# Altium project carte_pami26.PrjPcb
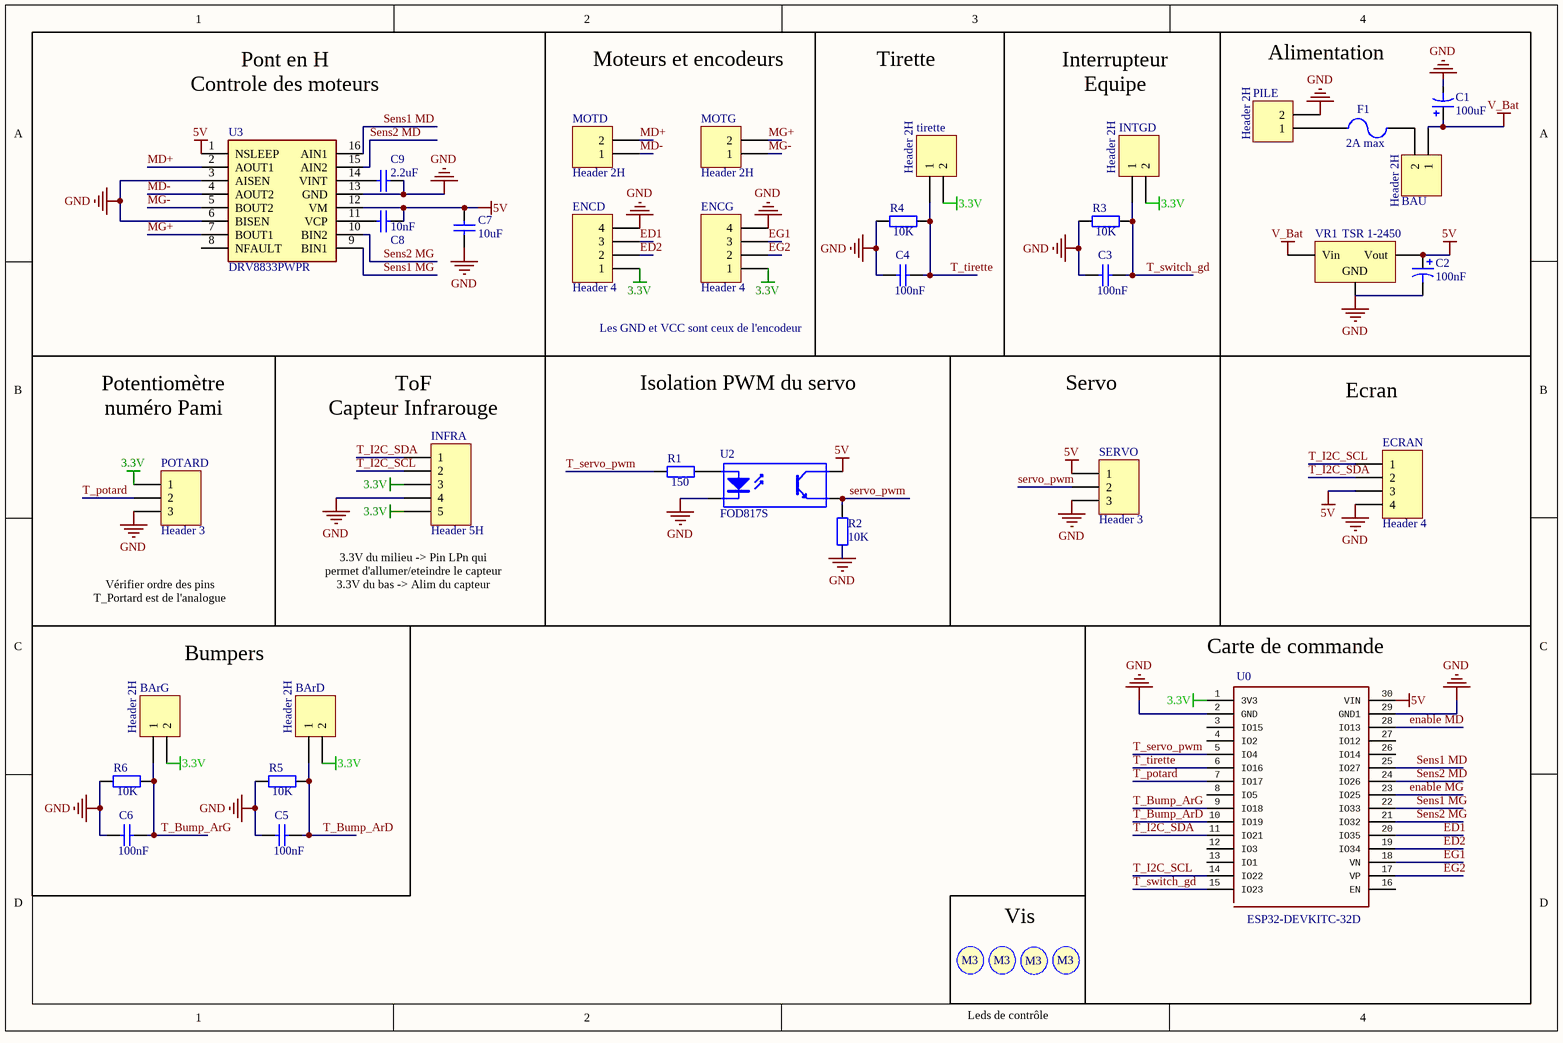
[diagram p0: carte_pami26.SchDoc]
1 sheet, 38 parts. Net scope: global (net labels, ports and power ports of the same name join across sheets).
Board file: carte_pami26.PcbDoc

## Sheet carte_pami26.SchDoc
size A4; SheetNumber: 1; SheetTotal: 1

### Parts
BArD  Header 2H  [JST_B2B-XH-A_(LF)(SN)]
BArG  Header 2H  [JST_B2B-XH-A_(LF)(SN)]
BAU  Header 2H  [JST_B2B-XH-A_(LF)(SN)]
C1  value 100uF  [Condensateur]  (hidden comment: 35V)
C2  value 100nF  [Condensateur]  (hidden comment: 35V)
C3  value 100nF  [Capacitor 1206]  (hidden comment: Cap)
C4  value 100nF  [Capacitor 1206]  (hidden comment: Cap)
C5  value 100nF  [Capacitor 1206]  (hidden comment: Cap)
C6  value 100nF  [Capacitor 1206]  (hidden comment: Cap)
C7  value 10uF  [Capacitor 1206]  (hidden comment: Cap)
C8  value 10nF  [Capacitor 1206]  (hidden comment: Cap)
C9  value 2.2uF  [Capacitor 1206]  (hidden comment: Cap)
ECRAN  Header 4  [B4BXHALFSN]
ENCD  Header 4  [B4BXHALFSN]
ENCG  Header 4  [B4BXHALFSN]
F1  2A max  [Fuse]
INFRA  Header 5H  [B5BXHAMLFSN]
INTGD  Header 2H  [JST_B2B-XH-A_(LF)(SN)]
MOTD  Header 2H  [JST_B2B-XH-A_(LF)(SN)]
MOTG  Header 2H  [JST_B2B-XH-A_(LF)(SN)]
PILE  Header 2H  [JST_B2B-XH-A_(LF)(SN)]
POTARD  Header 3  [JST_B3B-XH-A(LF)(SN)]
R1  value 150  [Resistor 1206]  (hidden comment: Res2)
R2  value 10K  [Resistor 1206]  (hidden comment: Res2)
R3  value 10K  [Resistor 1206]  (hidden comment: Res2)
R4  value 10K  [Resistor 1206]  (hidden comment: Res2)
R5  value 10K  [Resistor 1206]  (hidden comment: Res2)
R6  value 10K  [Resistor 1206]  (hidden comment: Res2)
S1  Screw M3  [Screw M3]  (value not drawn)
S2  Screw M3  [Screw M3]  (value not drawn)
S3  Screw M3  [Screw M3]  (value not drawn)
S4  Screw M3  [Screw M3]  (value not drawn)
SERVO  Header 3  [JST_B3B-XH-A(LF)(SN)]
tirette  Header 2H  [JST_B2B-XH-A_(LF)(SN)]
U0  ESP32-DEVKITC-32D  [MODULE_ESP32-DEVKITV1]
U2  FOD817S  [SOP254P1016X385-4N]
U3  DRV8833PWPR  [SOP65P640X120-16N]
VR1  TSR 1-2450  [TRS]

### Blocks framed on the sheet
Moteurs et encodeurs: ENCD ENCG MOTD MOTG
Tirette: C4 R4 tirette
Alimentation: BAU C1 C2 F1 PILE VR1
Isolation PWM du servo: R1 R2 U2
Servo: SERVO
Carte de commande: U0
Vis: S1-S4

### Nets
3.3V: BArD.2 BArG.2 ENCD.1 ENCG.1 INFRA.3 INFRA.5 INTGD.2 POTARD.1 tirette.2 U0.1(3V3)
5V: C2.1 C7.2 C8.1 ECRAN.3 SERVO.1 U0.30(VIN) U2.4(C) U3.1(NSLEEP) U3.12(VM) VR1.3(Vout)
GND: C1.2 C2.2 C3.1 C4.1 C5.1 C6.1 C7.1 C9.1 ECRAN.4 ENCD.4 ENCG.4 INFRA.4 PILE.2 POTARD.3 R2.1 R3.1 R4.1 R5.1 R6.1 SERVO.3 U0.2(GND) U0.29(GND1) U2.2(K) U3.3(AISEN) U3.6(BISEN) U3.13(GND)
V_Bat: BAU.1 C1.1 VR1.1(Vin)
ED1: ENCD.3 U0.20(IO35)
ED2: ENCD.2 U0.19(IO34)
EG1: ENCG.3 U0.18(VN)
EG2: ENCG.2 U0.17(VP)
enable MD: U0.28(IO13)
enable MG: U0.23(IO25)
MD+: MOTD.2 U3.2(AOUT1)
MD-: MOTD.1 U3.4(AOUT2)
MG+: MOTG.2 U3.7(BOUT1)
MG-: MOTG.1 U3.5(BOUT2)
Sens1 MD: U0.25(IO27) U3.16(AIN1)
Sens1 MG: U0.22(IO33) U3.9(BIN1)
Sens2 MD: U0.24(IO26) U3.15(AIN2)
Sens2 MG: U0.21(IO32) U3.10(BIN2)
servo_pwm: R2.2 SERVO.2 U2.3(E)
T_Bump_ArD: BArD.1 C5.2 R5.2 U0.10(IO19)
T_Bump_ArG: BArG.1 C6.2 R6.2 U0.9(IO18)
T_I2C_SCL: ECRAN.1 INFRA.2 U0.14(IO22)
T_I2C_SDA: ECRAN.2 INFRA.1 U0.11(IO21)
T_potard: POTARD.2 U0.7(IO17)
T_servo_pwm: R1.1 U0.5(IO4)
T_switch_gd: C3.2 INTGD.1 R3.2 U0.15(IO23)
T_tirette: C4.2 R4.2 tirette.1 U0.6(IO16)
NetBAU_2: BAU.2 F1.1
NetC8_2: C8.2 U3.11(VCP)
NetC9_2: C9.2 U3.14(VINT)
NetF1_2: F1.2 PILE.1
NetR1_2: R1.2 U2.1(A)

Not connected (* = marked no-connect by the designer): U0 3(IO15) 4(IO2) 8(IO5) 12(IO3) 13(IO1) 16(EN) 26(IO14) 27(IO12); U3 8(NFAULT); VR1 2(GND)

### Notes on the sheet
- Pont en H
  Controle des moteurs
- Interrupteur
  Equipe
- Les GND et VCC sont ceux de l'encodeur
- Potentiomètre
  numéro Pami
- (near INFRA) ToF
  Capteur Infrarouge
- Ecran
- Vérifier ordre des pins
  T_Portard est de l'analogue
- (near INFRA) 3.3V du milieu -> Pin LPn qui permet d'allumer/eteindre le capteur
  3.3V du bas -> Alim du capteur
- Bumpers
- Leds de contrôle
- (in symbol Screw M3) M3

### Library data of the parts
BArD BArG BAU INTGD MOTD MOTG PILE tirette = Header 2H: Header, 2-Pin, Right Angle; LatestRevisionDate: 17-Jul-2002; LatestRevisionNote: Re-released for DXP Platform.; Publisher: Altium Limited
C1 C2 = Cap Pol1: Polarized Capacitor (Radial); Published: 8-Jun-2000; LatestRevisionDate: 17-Jul-2002; LatestRevisionNote: Re-released for DXP Platform.; PackageReference: RB7.6-15; Publisher: Altium Limited; PackageDescription: Polarized Capacitor (Radial); 2 Leads
C3-C9 = Cap: Capacitor; Published: 8-Jun-2000; LatestRevisionDate: 17-Jul-2002; LatestRevisionNote: Re-released for DXP Platform.; PackageReference: RAD-0.3; Publisher: Altium Limited; PackageDescription: Radial Cap, Thru-Hole; 2 Leads; 0.3 in Pin Spacing
ECRAN ENCD ENCG = Header 4: Header, 4-Pin; LatestRevisionDate: 17-Jul-2002; LatestRevisionNote: Re-released for DXP Platform.; Publisher: Altium Limited
F1 = Fuse 2: Main Fuse; Published: 8-Jun-2000; LatestRevisionDate: 17-Jul-2002; LatestRevisionNote: Re-released for DXP Platform.; PackageReference: PIN-W2/E2.8; Publisher: Altium Limited; PackageDescription: Thru-Hole; 2 Leads
INFRA = Header 5H: Header, 5-Pin, Right Angle; LatestRevisionDate: 17-Jul-2002; LatestRevisionNote: Re-released for DXP Platform.; Publisher: Altium Limited
POTARD SERVO = Header 3: Header, 3-Pin; LatestRevisionDate: 17-Jul-2002; LatestRevisionNote: Re-released for DXP Platform.; Publisher: Altium Limited
R1-R6 = Res2: Resistor; Published: 8-Jun-2000; LatestRevisionDate: 17-Jul-2002; LatestRevisionNote: Re-released for DXP Platform.; PackageReference: AXIAL-0.4; Publisher: Altium Limited; PackageDescription: Axial Device, Thru-Hole; 2 Leads; 0.4 in Pin Spacing
U0 = ESP32-DEVKITC-32D: Eval Board For Esp-Wroom-32; MF: Espressif Systems; Availability: Unavailable; Package: None; SnapEDA_Link: https://www.snapeda.com/parts/ESP32-DEVKITC-32D/Espressif%20Systems/view-part/?ref=snap; MP: ESP32-DEVKITC-32D; Price: None; Value: *
U2 = Optoisolator1: 4-Pin Phototransistor Optocoupler; Published: 24-Mar-1999; LatestRevisionDate: 04-Mar-2005; LatestRevisionNote: Sch pins 3 & 4 Swapped.; DatasheetVersion: Nov-2003; PackageReference: DIP-4; Publisher: Altium Limited
U3 = DRV8833PWPR: Integrated Circuit; Manufacturer_Name: Texas Instruments; Datasheet Link: http://www.ti.com/lit/gpn/drv8833; Height: 1.2mm; Manufacturer_Part_Number: DRV8833PWPR; Mouser Part Number: 595-DRV8833PWPR; Mouser Price/Stock: https://www.mouser.co.uk/ProductDetail/Texas-Instruments/DRV8833PWPR?qs=luhu8ESwuKxT62RV9jrJTg%3D%3D; Arrow Part Number: DRV8833PWPR; Arrow Price/Stock: https://www.arrow.com/en/products/drv8833pwpr/texas-instruments.html?utm_currency=USD&region=nac
VR1 = Volt Reg: Voltage Regulator; Published: 24-Mar-1999; LatestRevisionDate: 29-May-2009; LatestRevisionNote: IPC-7351 Footprint Added.; PackageReference: D2PAK; Publisher: Altium Limited; PackageDescription: 3-Pin Transistor Outline Package 2.54 mm Pitch, 15.1 mm Lead Span